# Altium schematic sheet PCB_KIT_89S52_OBIT.SchDoc
size A0
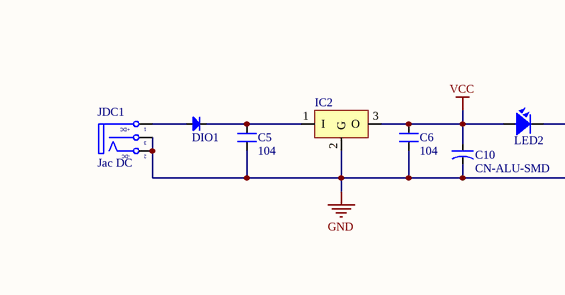
[diagram p0: PCB_KIT_89S52_OBIT.SchDoc, top left]
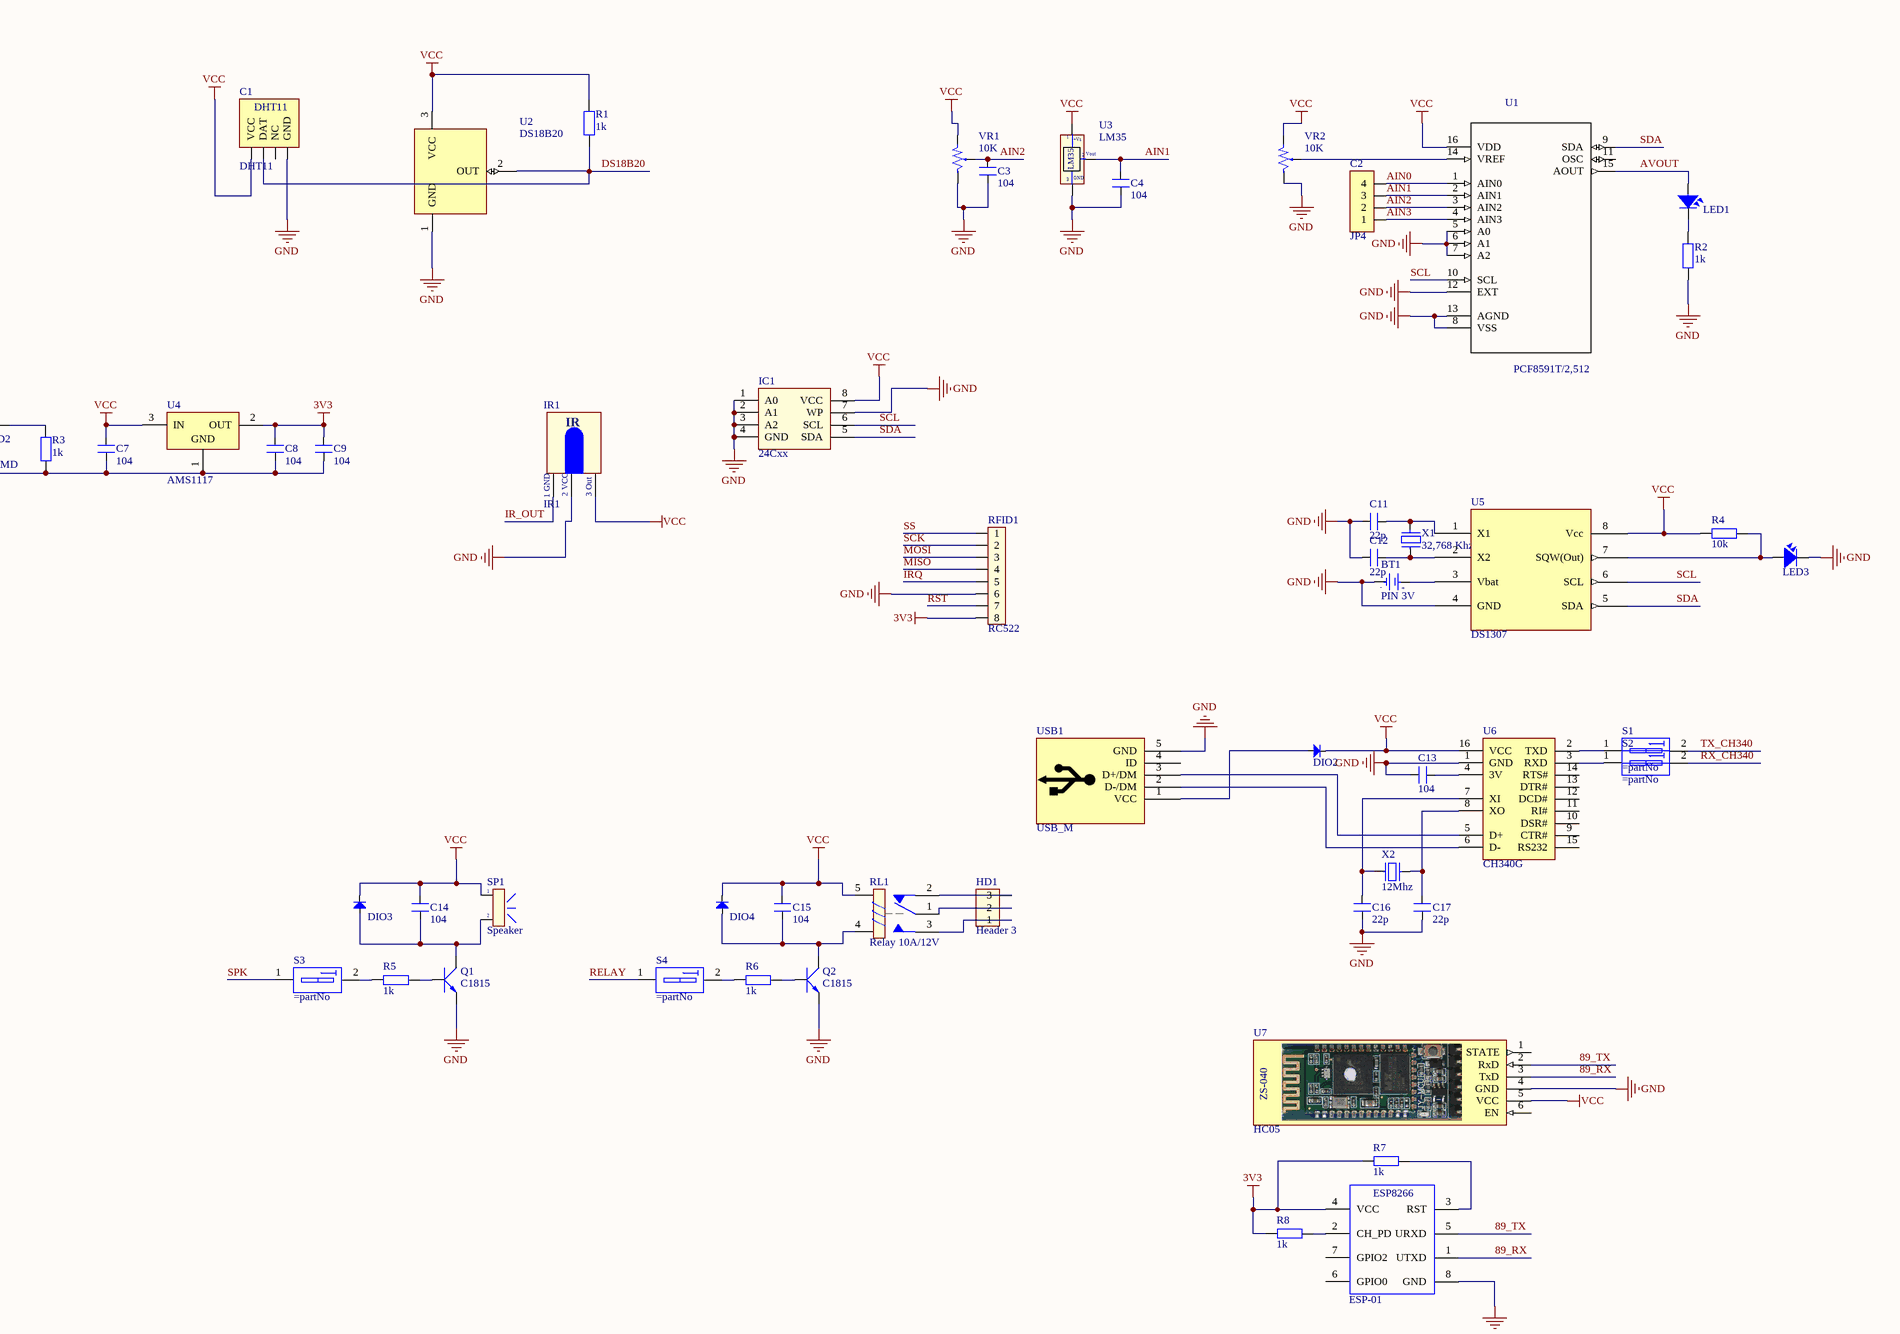
[diagram p1: PCB_KIT_89S52_OBIT.SchDoc, top right]
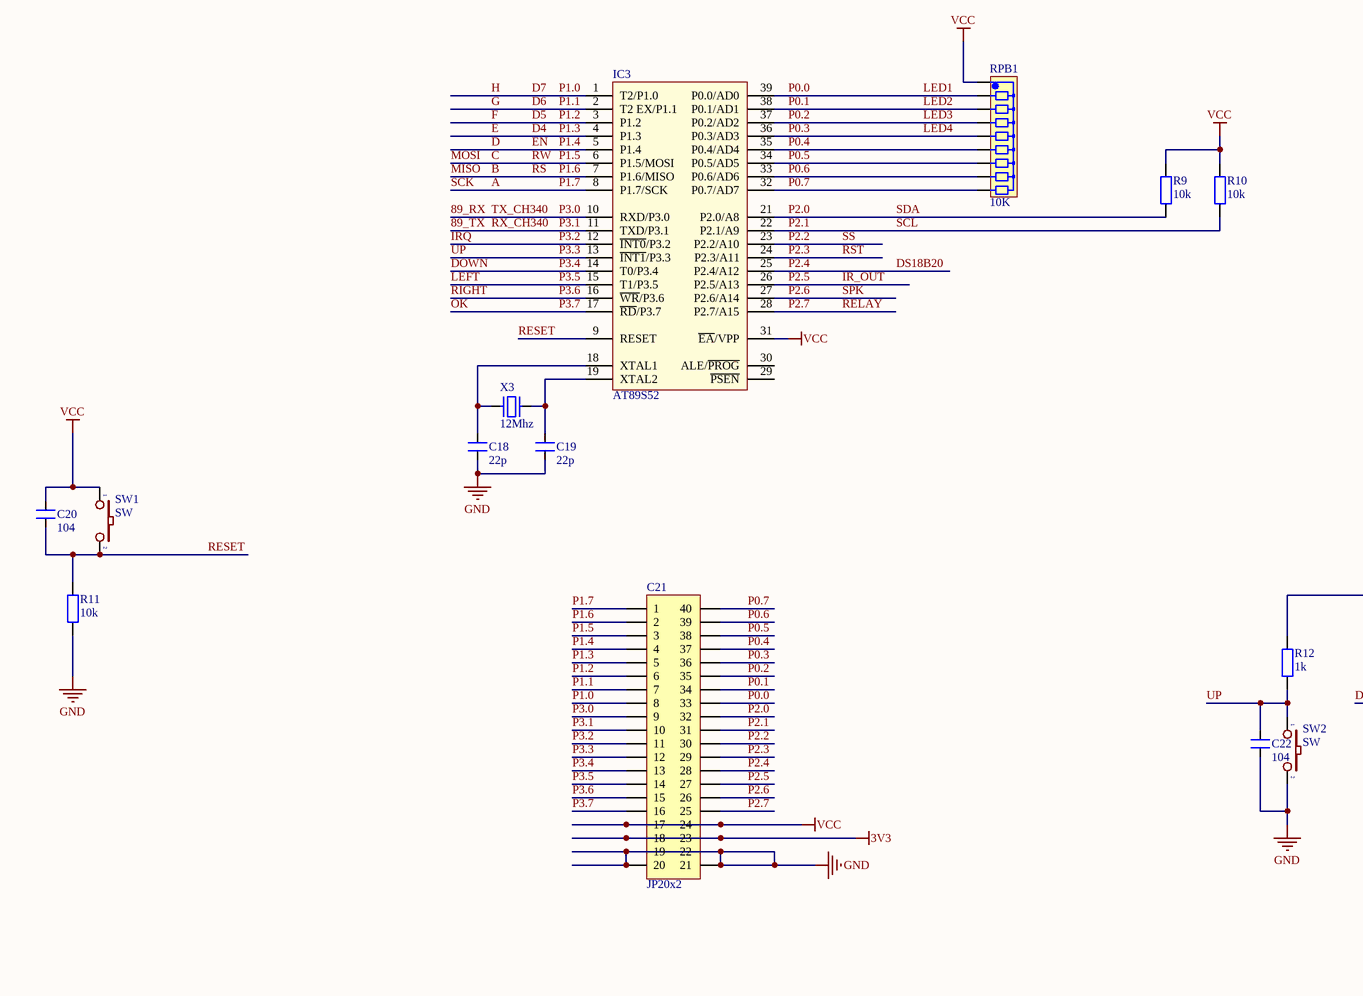
[diagram p2: PCB_KIT_89S52_OBIT.SchDoc, bottom left]
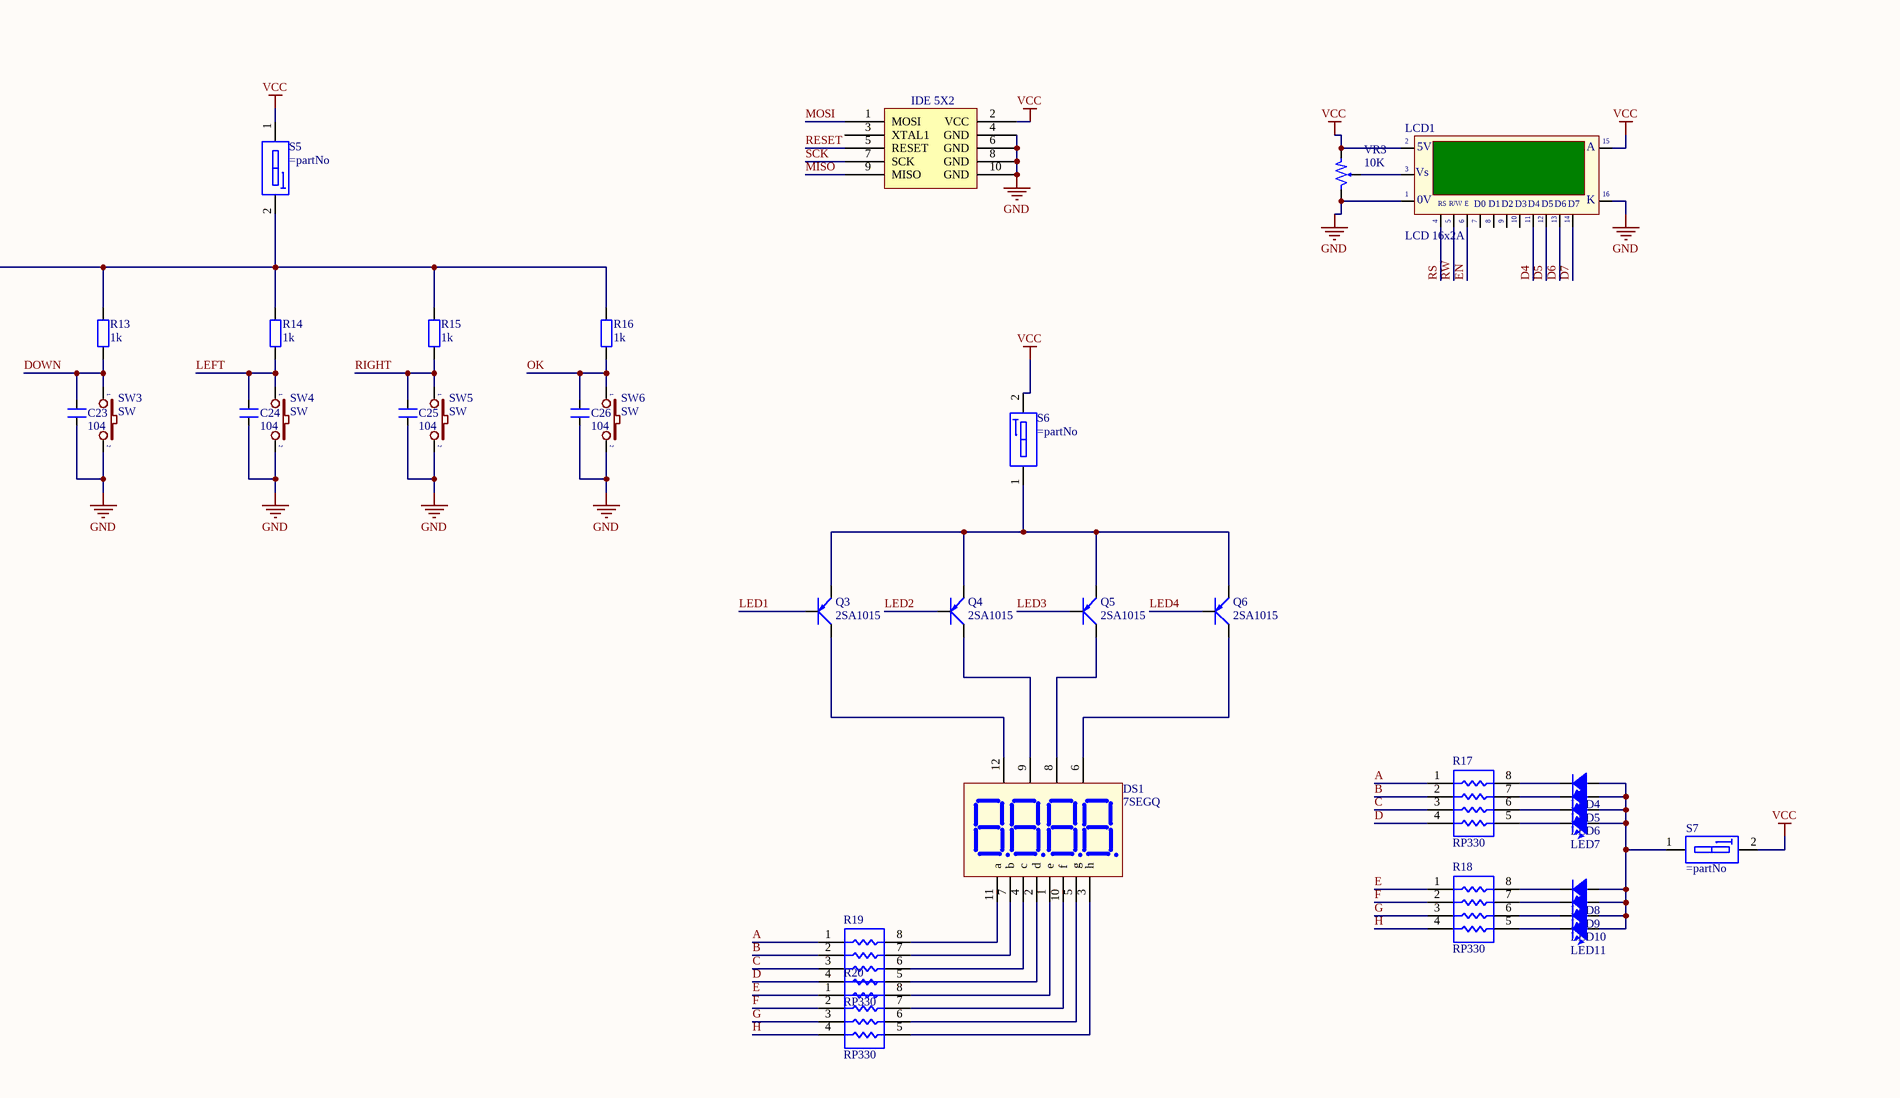
[diagram p3: PCB_KIT_89S52_OBIT.SchDoc, bottom right]

## Parts
BT1  PIN 3V  [PIN CR1220-SMD]
C1  DHT11  [DHT11]
C2  JP4  [JP4-C1T]
C3  104  [SM-0805]
C4  104  [SM-0805]
C5  104  [SM-0805]
C6  104  [SM-0805]
C7  104  [SM-0805]
C8  104  [SM-0805]
C9  104  [SM-0805]
C10  CN-ALU-SMD  [CAP-ALU-SMD-5.5x5.5]
C11  22p  [SM-0805]
C12  22p  [SM-0805]
C13  104  [SM-0805]
C14  104  [SM-0805]
C15  104  [SM-0805]
C16  22p  [SM-0805]
C17  22p  [SM-0805]
C18  22p  [SM-0805]
C19  22p  [SM-0805]
C20  104  [SM-0805]
C21  JP20x2  [JP20-C2T]
C22  104  [SM-0805]
C23  104  [SM-0805]
C24  104  [SM-0805]
C25  104  [SM-0805]
C26  104  [SM-0805]
DIO1  Diode SMD  [DIO-SMD-106]  (value not drawn)
DIO2  Diode SMD  [DIO-SMD-106]  (value not drawn)
DIO3  Diode SMD  [DIO-SMD-106]  (value not drawn)
DIO4  Diode SMD  [DIO-SMD-106]  (value not drawn)
DS1  7SEGQ  [LED7SEG-4-0.56]
HD1  Header 3  [HED3]
IC1  24Cxx  [SO8]
IC2  LM78xx  [TO252-123]  (value not drawn)
IC3  AT89S52  [DIP40_Socket]
IDE_1  IDE 5X2  [HDR2X5]
IR1  IR1  [IR2]
JDC1  Jac DC  [DC0]
LCD1  LCD 16x2A  [LCD16X2N]
LED1  LED  [LED-0805-Green]  (value not drawn)
LED2  LED  [LED-0805-Green]  (value not drawn)
LED3  LED  [LED-0805-Green]  (value not drawn)
LED4  LED  [LED-0805-Green]  (value not drawn)
LED5  LED  [LED-0805-Green]  (value not drawn)
LED6  LED  [LED-0805-Green]  (value not drawn)
LED7  LED  [LED-0805-Green]  (value not drawn)
LED8  LED  [LED-0805-Green]  (value not drawn)
LED9  LED  [LED-0805-Green]  (value not drawn)
LED10  LED  [LED-0805-Green]  (value not drawn)
LED11  LED  [LED-0805-Green]  (value not drawn)
Q1  C1815  [SOT23B]
Q2  C1815  [SOT23B]
Q3  2SA1015  [SOT23-321]
Q4  2SA1015  [SOT23-321]
Q5  2SA1015  [SOT23-321]
Q6  2SA1015  [SOT23-321]
R1  1k  [SM-RES-0805]
R2  1k  [SM-RES-0805]
R3  1k  [SM-RES-0805]
R4  10k  [SM-RES-0805]
R5  1k  [SM-RES-0805]
R6  1k  [SM-RES-0805]
R7  1k  [SM-RES-0805]
R8  1k  [SM-RES-0805]
R9  10k  [SM-RES-0805]
R10  10k  [SM-RES-0805]
R11  10k  [SM-RES-0805]
R12  1k  [SM-RES-0805]
R13  1k  [SM-RES-0805]
R14  1k  [SM-RES-0805]
R15  1k  [SM-RES-0805]
R16  1k  [SM-RES-0805]
R17  RP330  [RESCAXS50P160X320X70-8N]
R18  RP330  [RESCAXS50P160X320X70-8N]
R19  RP330  [RESCAXS50P160X320X70-8N]
R20  RP330  [RESCAXS50P160X320X70-8N]
RFID1  RC522  [JP8]
RL1  Relay 10A/12V  [RL_SPDT_10A]
RPB1  10K  [RN8]
S1  (no value)  [SW-DIP1-1]
S2  (no value)  [SW-DIP1-1]
S3  (no value)  [SW-DIP1-1]
S4  (no value)  [SW-DIP1-1]
S5  (no value)  [SW-DIP1-1]
S6  (no value)  [SW-DIP1-1]
S7  (no value)  [SW-DIP1-1]
SP1  Speaker  [SPK]
SW1  SW  [SW1-SMD]
SW2  SW  [SW1-SMD]
SW3  SW  [SW1-SMD]
SW4  SW  [SW1-SMD]
SW5  SW  [SW1-SMD]
SW6  SW  [SW1-SMD]
U1  PCF8591T/2,512  [SOIC127P1032X265-16N]
U2  DS18B20  [TO-92A]
U3  LM35  [TO92-123]
U4  AMS1117  [SOT 223]
U5  DS1307  [SOP 8]
U6  CH340G  [SO16]
U7  HC05  [JP6-C1T]
U8  ESP-01  [ESP8266]
USB1  USB_M  [USB-M1]
VR1  10K  [VR1]
VR2  10K  [VR1]
VR3  10K  [VR]
X1  32,768 Khz  [XT32k]
X2  12Mhz  [XT2]
X3  12Mhz  [XT2]

## Nets
3V3: C8.1 C9.1 C21.18 C21.23 R7.1 R8.1 RFID1.8 U4.2(OUT) U8.4(VCC)
GND: BT1.2(GND) C1.4(GND) C3.2 C4.2 C5.2 C6.2 C7.2 C8.2 C9.2 C10.2 C11.2 C12.2 C13.1 C16.2 C17.2 C18.2 C19.2 C21.19 C21.20 C21.21 C21.22 C22.2 C23.2 C24.2 C25.2 C26.2 IC1.1(A0) IC1.2(A1) IC1.3(A2) IC1.4(GND) IC1.7(WP) IC2.2(G) IC3.20(GND) IDE_1.4(GND) IDE_1.6(GND) IDE_1.8(GND) IDE_1.10(GND) IR1.2(GND) JDC1.2(TN) JDC1.3(S) LCD1.1(GND) LCD1.16(K) LED3.2 Q1.1(E) Q2.1(E) R2.2 R3.2 R11.2 RFID1.6 SW2.2 SW3.2 SW4.2 SW5.2 SW6.2 U1.5(A0) U1.6(A1) U1.7(A2) U1.8(VSS) U1.12(EXT) U1.13(AGND) U2.1(GND) U3.3(-) U4.1(GND) U5.4(GND) U6.1(GND) U7.4(GND) U8.8(GND) USB1.5(GND) VR1.3 VR2.3 VR3.3
VCC: C1.1(VCC) C6.1 C7.1 C10.1 C14.1 C15.1 C20.1 C21.17 C21.24 DIO2.2(K) DIO3.2(K) DIO4.2(K) IC1.8(VCC) IC2.3(O) IC3.31(~{EA}/VPP) IC3.40(VCC) IDE_1.2(VCC) IR1.3(VCC) LCD1.2(VDD) LCD1.15(A) LED2.1 R1.1 R4.2 R9.1 R10.1 RL1.5 RPB1.1 S5.1 S6.2 S7.2 SP1.1 SW1.1 U1.16(VDD) U2.3(VCC) U3.1(+Vs) U4.3(IN) U5.8(Vcc) U6.16(VCC) U7.5(VCC) VR1.1 VR2.1 VR3.1
89_RX: C21.9 IC3.10(RXD/P3.0) S1.2 U7.3(TxD) U8.1(UTXD)  [also labelled P3.0, TX_CH340]
89_TX: C21.10 IC3.11(TXD/P3.1) S2.2 U7.2(RxD) U8.5(URXD)  [also labelled P3.1, RX_CH340]
A: C21.1 IC3.8(P1.7/SCK) IDE_1.7(SCK) R17.1 R19.1 RFID1.2  [also labelled P1.7, SCK]
AIN0: C2.4 U1.1(AIN0)
AIN1: C2.3 C4.1 U1.2(AIN1) U3.2(Vout)
AIN2: C2.2 C3.1 U1.3(AIN2) VR1.2
AIN3: C2.1 U1.4(AIN3)
AVOUT: LED1.1 U1.15(AOUT)
B: C21.2 IC3.7(P1.6/MISO) IDE_1.9(MISO) LCD1.4(RS) R17.2 R19.2 RFID1.4  [also labelled MISO, P1.6, RS]
C: C21.3 IC3.6(P1.5/MOSI) IDE_1.1(MOSI) LCD1.5(R/~{W}) R17.3 R19.3 RFID1.3  [also labelled MOSI, P1.5, RW]
D: C21.4 IC3.5(P1.4) LCD1.6(~{EN}) R17.4 R19.4  [also labelled EN, P1.4]
D4: C21.5 IC3.4(P1.3) LCD1.11(D4) R18.1 R20.1  [also labelled E, P1.3]
D5: C21.6 IC3.3(P1.2) LCD1.12(D5) R18.2 R20.2  [also labelled F, P1.2]
D6: C21.7 IC3.2(T2_EX/P1.1) LCD1.13(D6) R18.3 R20.3  [also labelled G, P1.1]
D7: C21.8 IC3.1(T2/P1.0) LCD1.14(D7) R18.4 R20.4  [also labelled H, P1.0]
DOWN: C21.13 C23.1 IC3.14(T0/P3.4) R13.2 SW3.1  [also labelled P3.4]
DS18B20: C1.2(DAT) C21.28 IC3.25(P2.4/A12) R1.2 U2.2(OUT)  [also labelled P2.4]
IR_OUT: C21.27 IC3.26(P2.5/A13) IR1.1(Out)  [also labelled P2.5]
IRQ: C21.11 IC3.12(~{INT0}/P3.2) RFID1.5  [also labelled P3.2]
LED1: C21.33 IC3.39(P0.0/AD0) Q3.3(B) RPB1.2  [also labelled P0.0]
LED2: C21.34 IC3.38(P0.1/AD1) Q4.3(B) RPB1.3  [also labelled P0.1]
LED3: C21.35 IC3.37(P0.2/AD2) Q5.3(B) RPB1.4  [also labelled P0.2]
LED4: C21.36 IC3.36(P0.3/AD3) Q6.3(B) RPB1.5  [also labelled P0.3]
LEFT: C21.14 C24.1 IC3.15(T1/P3.5) R14.2 SW4.1  [also labelled P3.5]
OK: C21.16 C26.1 IC3.17(~{RD}/P3.7) R16.2 SW6.1  [also labelled P3.7]
P0.4: C21.37 IC3.35(P0.4/AD4) RPB1.6
P0.5: C21.38 IC3.34(P0.5/AD5) RPB1.7
P0.6: C21.39 IC3.33(P0.6/AD6) RPB1.8
P0.7: C21.40 IC3.32(P0.7/AD7) RPB1.9
P2.0: C21.32 IC1.5(SDA) IC3.21(P2.0/A8) R9.2 U1.9(SDA) U5.5(SDA)  [also labelled SDA]
P2.1: C21.31 IC1.6(SCL) IC3.22(P2.1/A9) R10.2 U1.10(SCL) U5.6(SCL)  [also labelled SCL]
P2.2: C21.30 IC3.23(P2.2/A10) RFID1.1  [also labelled SS]
P2.3: C21.29 IC3.24(P2.3/A11) RFID1.7  [also labelled RST]
P2.6: C21.26 IC3.27(P2.6/A14) S3.1  [also labelled SPK]
P2.7: C21.25 IC3.28(P2.7/A15) S4.1  [also labelled RELAY]
P3.3: C21.12 C22.1 IC3.13(~{INT1}/P3.3) R12.2 SW2.1  [also labelled UP]
P3.6: C21.15 C25.1 IC3.16(~{WR}/P3.6) R15.2 SW5.1  [also labelled RIGHT]
RESET: C20.2 IC3.9(RESET) IDE_1.5(RESET) R11.1 SW1.2
NetBT1_1: BT1.1(+3V) U5.3(Vbat)
NetC5_1: C5.1 DIO1.2(K) IC2.1(I)
NetC11_1: C11.1 U5.1(X1) X1.2
NetC12_1: C12.1 U5.2(X2) X1.1
NetC13_2: C13.2 U6.4(3V)
NetC14_2: C14.2 DIO3.1(A) Q1.2(C) SP1.2
NetC15_2: C15.2 DIO4.1(A) Q2.2(C) RL1.4
NetC16_1: C16.1 U6.7(XI) X2.1
NetC17_1: C17.1 U6.8(XO) X2.2
NetC18_1: C18.1 IC3.18(XTAL1) X3.1
NetC19_1: C19.1 IC3.19(XTAL2) X3.2
NetDIO1_1: DIO1.1(A) JDC1.1(T)
NetDIO2_1: DIO2.1(A) USB1.1(VCC)
NetDS1_1: DS1.1(e) R20.8
NetDS1_2: DS1.2(d) R19.5
NetDS1_3: DS1.3(h) R20.5
NetDS1_4: DS1.4(c) R19.6
NetDS1_5: DS1.5(g) R20.6
NetDS1_6: DS1.6(V4) Q6.2(C)
NetDS1_7: DS1.7(b) R19.7
NetDS1_8: DS1.8(V3) Q5.2(C)
NetDS1_9: DS1.9(V2) Q4.2(C)
NetDS1_10: DS1.10(f) R20.7
NetDS1_11: DS1.11(a) R19.8
NetDS1_12: DS1.12(V1) Q3.2(C)
NetHD1_1: HD1.1 RL1.3
NetHD1_2: HD1.2 RL1.1
NetHD1_3: HD1.3 RL1.2
NetLCD1_3: LCD1.3(VEE) VR3.2
NetLED1_2: LED1.2 R2.1
NetLED2_2: LED2.2 R3.1
NetLED3_1: LED3.1 R4.1 U5.7(SQW(Out))
NetLED4_1: LED4.1 LED5.1 LED6.1 LED7.1 LED8.1 LED9.1 LED10.1 LED11.1 S7.1
NetLED4_2: LED4.2 R17.8
NetLED5_2: LED5.2 R17.7
NetLED6_2: LED6.2 R17.6
NetLED7_2: LED7.2 R17.5
NetLED8_2: LED8.2 R18.8
NetLED9_2: LED9.2 R18.7
NetLED10_2: LED10.2 R18.6
NetLED11_2: LED11.2 R18.5
NetQ1_3: Q1.3(B) R5.1
NetQ2_3: Q2.3(B) R6.1
NetQ3_1: Q3.1(E) Q4.1(E) Q5.1(E) Q6.1(E) S6.1
NetR5_2: R5.2 S3.2
NetR6_2: R6.2 S4.2
NetR7_2: R7.2 U8.3(RST)
NetR8_2: R8.2 U8.2(CH_PD)
NetR12_1: R12.1 R13.1 R14.1 R15.1 R16.1 S5.2
NetS1_1: S1.1 U6.2(TXD)
NetS2_1: S2.1 U6.3(RXD)
NetU1_14: U1.14(VREF) VR2.2
NetU6_5: U6.5(D+) USB1.3(D+/DM)
NetU6_6: U6.6(D-) USB1.2(D-/DM)

Not connected (* = marked no-connect by the designer): C1 3(NC); IC3 29(~{PSEN}) 30(ALE/~{PROG}); IDE_1 3(XTAL1); LCD1 7(D0) 8(D1) 9(D2) 10(D3); U1 11(OSC); U6 9(CTR#) 10(DSR#) 11(RI#) 12(DCD#) 13(DTR#) 14(RTS#) 15(RS232); U7 1(STATE) 6(EN); U8 6(GPIO0) 7(GPIO2); USB1 4(ID)

## Notes on the sheet
- (in symbol DCIN) +DC; -DC
- (in symbol ESP8266-01) ESP8266
- (in symbol IR1) IR; 1 GND; 2 VCC; 3 Out
- (in symbol LCD16x2A) 5V; Vs; |; 0V; R/W; E
- (in symbol LM35) GND
- (in symbol Module ZS-040 (HC05)) ZS-040
- (in symbol PIN 3V) -; +

## Library data of the parts
BT1 = PIN 3V: Battery 3VDC; Value: PIN 3V
C1 = DHT11: Manufacturer: W¨¹rth Elektronik eiSos GmbH; partNo: 613004143121; ComponentLink1 Description: Manufacturer; ComponentLink2 Description: Datasheet; NoPins: 04; Created Date: 29 March 2013; ComponentLink1URL: http://www.we-online.com; ComponentLink2URL: http://katalog.we-online.de/em/datasheet/6130xx143121.pdf; Created by: Karrer Zheng
C2 = JP4: WR-PHD 2.54 mm Angled Socket Header; Manufacturer: W¨¹rth Elektronik eiSos GmbH; partNo: 613004143121; ComponentLink1 Description: Manufacturer; ComponentLink2 Description: Datasheet; NoPins: 04; Created Date: 29 March 2013; ComponentLink1URL: http://www.we-online.com; ComponentLink2URL: http://katalog.we-online.de/em/datasheet/6130xx143121.pdf; Created by: Karrer Zheng
C3-C9 C11-C20 C22-C26 = CM: Cap SMD; Value: 103
C10 = CN-ALU-SMD: Polarized Capacitor (Axial); Published: 8-Jun-2000; LatestRevisionDate: 17-Jul-2002; LatestRevisionNote: Re-released for DXP Platform.; PackageReference: POLAR0.8; Publisher: Altium Limited
C21 = JP20x2: WR-PHD 2.54 mm Dual Socket Header; Manufacturer: W¨¹rth Elektronik eiSos GmbH; partNo: 61304021821; ComponentLink1 Description: Manufacturer; ComponentLink2 Description: Datasheet; NoPins: 40; Created Date: 29 March 2013; ComponentLink1URL: http://www.we-online.com; ComponentLink2URL: http://katalog.we-online.de/em/datasheet/6130xx21821.pdf; Created by: Karrer Zheng
DIO1-DIO4 = Diode SMD: Default Diode; Code - JEDEC: DO-214-AB; Value: 1N5007; Published: 8-Jun-2000; Revision: July-2002: Re-released for DXP Platform.; Publisher: Altium Limited
DS1 = LED7SEG-4: Four 7 Seg Dipslay; Value: LED 7Q SEG
HD1 = Hed3: Header 3 (Green); Value: Header 3
IC1 = 24Cxx: Standard 2-Wire Bus Interface Serial EEPROM; Value: DIP 8; Value: 24Cxx; Copyright by: VanDungEvn
IC2 = LM78xx: Positive Voltage Regulator; Note: Tab is connected to pin 3 (GND).; Published: 24-Aug-2001; LatestRevisionDate: 17-Jul-2002; LatestRevisionNote: Re-released for DXP Platform.; DatasheetVersion: Apr-1994; PackageVersion: Jul-1998; PackageReference: ISOWATT220AB; Publisher: Altium Limited; PackageDescription: TO, Thru-Hole, Vertical, Heatsink Mounted; 3 In-Line Leads; Pitch 2.54 mm; Pin sequence 1, 3, 2; ComponentLink1Description: Manufacturer Link; ComponentLink1URL: http://www.st.com/; ComponentLink2Description: Datasheet; ComponentLink2URL: http://www.st.com/stonline/products/literature/ds/2146/l78m05c.pdf
IC3 = AT89S52: AT89S52, 8k Byte Flash Memory , 40 Pin; Value: AT89S52
IDE_1 = ISP: IDE 5X2 DUC-THANG
IR1 = IR1: Receiver Infraed IC
JDC1 = DCIN: Jac DC input; Value: Jac DC
LCD1 = LCD16x2A: LCD dipslay 16 char, 2 line; Value: LCD16x2A
LED1-LED11 = LED SMD: Value: LED 3 - 5 ly 2 Colour
Q1 Q2 = C1815: NPN 600mW, ECB; Value: C1815
Q3-Q6 = 2SA1015: PNP 600mW, ECB; Value: A1015
R1-R16 = R1/4W: Resistor 1/4W; Value: R1/4W - 1K
R17-R20 = ResPack
RFID1 = JP8: JP8 PIN; Value: JP7
RL1 = Relay 1: Relay SPDT,10A - 12VDC 5 Pin; Value: Relay SPDT, 10A, 12V
RPB1 = RN8: Resistor 8 (Thanh); Value: Tro thanh 10K
S1-S7 = SWDIP1: WS-DITV 2.54 mm small compact THT flat actuator with top tape; Manufacturer: Wurth Elektronik; Part No.: 418127160901; ComponentLink1 Description: Manufacturer; ComponentLink2 Description: Datasheet; Pole: 01; Created Date: Dec.2015; ComponentLink1URL: http://www.we-online.com; ComponentLink2URL: http://katalog.we-online.de/em/datasheet/4181271609xx.pdf; Created by: Baojun Chen
SP1 = SPK: Speaker Chip; Value: Speaker Chip
SW1-SW6 = SW2: Switch button 2 pin; Value: SW chip 2 pin
U1 = PCF8591T/2,512: PCF8591 Series 2.5 V - 6 V Bá»™ chuyá»ƒn Ä‘á»•i A / D 8-bit vÃ  D / A - SOIC - 16; MF: NXP Semiconductors; Availability: Unavailable; MP: PCF8591T/2,512; SnapEDA_Link: https://www.snapeda.com/parts/PCF8591T/2%2C512/NXP%20Semiconductors/view-part/?ref=snap; Price: None; Package: SOIC-16 NXP Semiconductors; Value: *
U2 = DS18B20: 1-Wire Digital Thermometer; Creator: Cao Van Huong; Website: http://hlab.vn
U3 = LM35: Teminal; Value: LM35
U4 = AMS117
U5 = DS1307: 64 X 8 Serial Real-Time Clock
U6 = CH340G: High and Low Side Driver; Note: Pins 4, 8 and 14 are not connected; Published: 8-Jun-2000; LatestRevisionDate: 04-Mar-2005; LatestRevisionNote: Stylized 3D Model Added.; DatasheetVersion: PD60147J; PackageReference: PDIP14; Publisher: Altium Limited; PackageDescription: DIP; 14 Leads; Row Spacing 7.62 mm; Pitch 2.54 mm; ComponentLink1Description: Manufacturer Link; ComponentLink1URL: http://www.irf.com/; ComponentLink2Description: Datasheet; ComponentLink2URL: http://www.irf.com/product-info/datasheets/data/ir2110.pdf
U7 = Module ZS-040 (HC05)
U8 = ESP8266-01: ESP-12 Wi-Fi Module
VR1-VR3 = VR1: Var Resistor; Value: VR 10K
X1 = XT32k: Crystal 32,768kHz for timer real; Value: 32,768khz
X2 X3 = XT2: Crystal, 32.768 KHz, -40 to 85 degC, 3.2 x 1.5 x 0.9 mm SMD; Value: 4Mhz